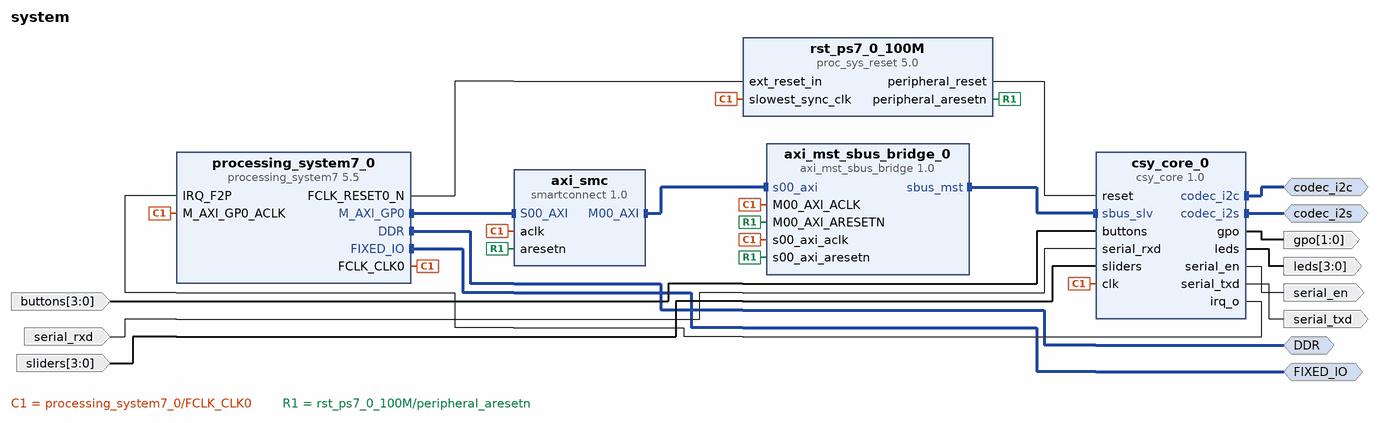
[diagram p0: block diagram of the top level]
# Vivado block design system, xc7z010clg400-1, Vivado 2017.2
create_bd_design system

create_bd_intf_port -mode Master -vlnv xilinx.com:interface:ddrx_rtl:1.0 DDR
create_bd_intf_port -mode Master -vlnv xilinx.com:display_processing_system7:fixedio_rtl:1.0 FIXED_IO
create_bd_intf_port -mode Master -vlnv fh-joanneum.local:user:i2c_rtl:1.0 codec_i2c
create_bd_intf_port -mode Master -vlnv fh-joanneum.local:user:i2s_rtl:1.0 codec_i2s
create_bd_port -dir O serial_en
create_bd_port -dir O serial_txd
create_bd_port -dir I -from 3 -to 0 buttons
create_bd_port -dir I serial_rxd
create_bd_port -dir I -from 3 -to 0 sliders
create_bd_port -dir O -from 3 -to 0 leds
create_bd_port -dir O -from 1 -to 0 gpo

create_bd_cell -type ip -vlnv xilinx.com:ip:processing_system7:5.5 processing_system7_0
set_property -dict [list \
  CONFIG.PCW_UIPARAM_DDR_FREQ_MHZ 525 \
  CONFIG.PCW_CRYSTAL_PERIPHERAL_FREQMHZ 50.000000 \
  CONFIG.PCW_APU_PERIPHERAL_FREQMHZ 650 \
  CONFIG.PCW_SDIO_PERIPHERAL_FREQMHZ 50 \
  CONFIG.PCW_FPGA0_PERIPHERAL_FREQMHZ 100 \
  CONFIG.PCW_USE_FABRIC_INTERRUPT 1 \
  CONFIG.PCW_IRQ_F2P_INTR 1 \
  CONFIG.PCW_PRESET_BANK1_VOLTAGE {LVCMOS 1.8V} \
  CONFIG.PCW_UIPARAM_DDR_PARTNO {MT41K128M16 JT-125} \
  CONFIG.PCW_QSPI_PERIPHERAL_ENABLE 1 \
  CONFIG.PCW_QSPI_GRP_SINGLE_SS_ENABLE 1 \
  CONFIG.PCW_QSPI_GRP_FBCLK_ENABLE 1 \
  CONFIG.PCW_ENET0_PERIPHERAL_ENABLE 1 \
  CONFIG.PCW_ENET0_ENET0_IO {MIO 16 .. 27} \
  CONFIG.PCW_ENET0_GRP_MDIO_ENABLE 1 \
  CONFIG.PCW_ENET0_RESET_ENABLE 0 \
  CONFIG.PCW_SD0_PERIPHERAL_ENABLE 1 \
  CONFIG.PCW_SD0_GRP_CD_ENABLE 1 \
  CONFIG.PCW_SD0_GRP_CD_IO {MIO 47} \
  CONFIG.PCW_SD0_GRP_WP_ENABLE 1 \
  CONFIG.PCW_UART1_PERIPHERAL_ENABLE 1 \
  CONFIG.PCW_TTC0_PERIPHERAL_ENABLE 1 \
  CONFIG.PCW_USB0_PERIPHERAL_ENABLE 1 \
  CONFIG.PCW_USB0_RESET_ENABLE 1 \
  CONFIG.PCW_USB0_RESET_IO {MIO 46} \
  CONFIG.PCW_GPIO_MIO_GPIO_ENABLE 1 \
] [get_bd_cells processing_system7_0]
# 105 more settings of processing_system7_0 are not shown: defaults, MIO pin electricals, DDR timing, and values the tool derives
create_bd_cell -type ip -vlnv fh-joanneum.local:user:axi_mst_sbus_bridge:1.0 axi_mst_sbus_bridge_0
create_bd_cell -type ip -vlnv xilinx.com:ip:smartconnect:1.0 axi_smc
set_property -dict {CONFIG.NUM_SI 1} [get_bd_cells axi_smc]
create_bd_cell -type ip -vlnv xilinx.com:ip:proc_sys_reset:5.0 rst_ps7_0_100M
create_bd_cell -type ip -vlnv fh-joanneum.local:user:csy_core:1.0 csy_core_0
set_property -dict {CONFIG.C_CORE_CLK_FREQUENCY 100000000 CONFIG.C_SLV_ADDR_BASE 0x2000} [get_bd_cells csy_core_0]

# ---- connections ----

connect_bd_intf_net [get_bd_intf_pins processing_system7_0/M_AXI_GP0] [get_bd_intf_pins axi_smc/S00_AXI]
connect_bd_intf_net [get_bd_intf_pins axi_smc/M00_AXI] [get_bd_intf_pins axi_mst_sbus_bridge_0/s00_axi]
connect_bd_intf_net [get_bd_intf_pins axi_mst_sbus_bridge_0/sbus_mst] [get_bd_intf_pins csy_core_0/sbus_slv]
connect_bd_intf_net [get_bd_intf_ports DDR] [get_bd_intf_pins processing_system7_0/DDR]
connect_bd_intf_net [get_bd_intf_ports FIXED_IO] [get_bd_intf_pins processing_system7_0/FIXED_IO]
connect_bd_intf_net [get_bd_intf_ports codec_i2c] [get_bd_intf_pins csy_core_0/codec_i2c]
connect_bd_intf_net [get_bd_intf_ports codec_i2s] [get_bd_intf_pins csy_core_0/codec_i2s]
connect_bd_net [get_bd_pins processing_system7_0/FCLK_CLK0] \
  [get_bd_pins processing_system7_0/M_AXI_GP0_ACLK] [get_bd_pins axi_smc/aclk] \
  [get_bd_pins axi_mst_sbus_bridge_0/s00_axi_aclk] [get_bd_pins rst_ps7_0_100M/slowest_sync_clk] \
  [get_bd_pins axi_mst_sbus_bridge_0/M00_AXI_ACLK] [get_bd_pins csy_core_0/clk]
connect_bd_net [get_bd_pins processing_system7_0/FCLK_RESET0_N] [get_bd_pins rst_ps7_0_100M/ext_reset_in]
connect_bd_net [get_bd_pins rst_ps7_0_100M/peripheral_aresetn] \
  [get_bd_pins axi_mst_sbus_bridge_0/s00_axi_aresetn] [get_bd_pins axi_smc/aresetn] \
  [get_bd_pins axi_mst_sbus_bridge_0/M00_AXI_ARESETN]
connect_bd_net [get_bd_ports buttons] [get_bd_pins csy_core_0/buttons]
connect_bd_net [get_bd_ports serial_rxd] [get_bd_pins csy_core_0/serial_rxd]
connect_bd_net [get_bd_ports sliders] [get_bd_pins csy_core_0/sliders]
connect_bd_net [get_bd_pins csy_core_0/serial_en] [get_bd_ports serial_en]
connect_bd_net [get_bd_pins csy_core_0/serial_txd] [get_bd_ports serial_txd]
connect_bd_net [get_bd_pins rst_ps7_0_100M/peripheral_reset] [get_bd_pins csy_core_0/reset]
connect_bd_net [get_bd_pins csy_core_0/irq_o] [get_bd_pins processing_system7_0/IRQ_F2P]
connect_bd_net [get_bd_pins csy_core_0/leds] [get_bd_ports leds]
connect_bd_net [get_bd_pins csy_core_0/gpo] [get_bd_ports gpo]

# ---- address map ----
assign_bd_address -offset 0x43C00000 -range 256K -target_address_space [get_bd_addr_spaces processing_system7_0/Data] [get_bd_addr_segs axi_mst_sbus_bridge_0/s00_axi/reg0]

validate_bd_design
save_bd_design
